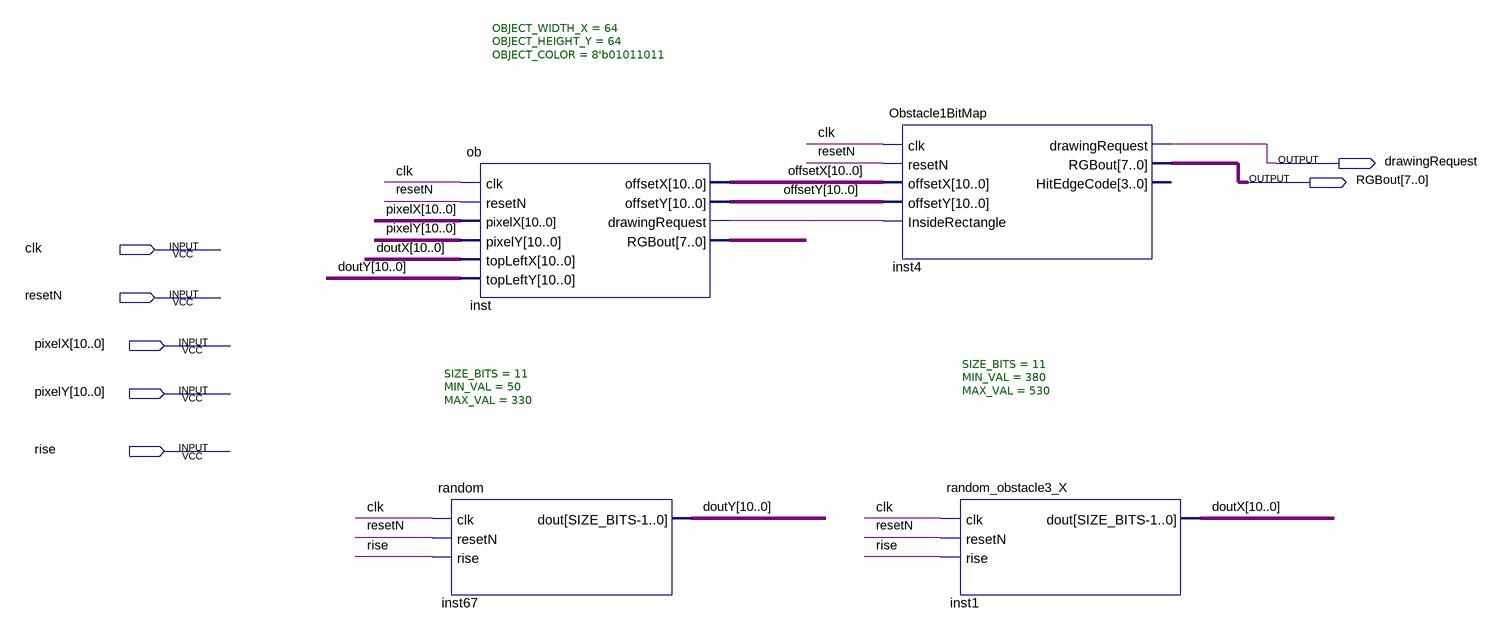
[diagram p0: schematic sheet]
// Quartus schematic Obstacle3.bdf as structural Verilog: 4 symbols, 7 pins
module Obstacle3 (
  input  clk,
  input  resetN,
  input  [10:0] pixelX,
  input  [10:0] pixelY,
  input  rise,
  output drawingRequest,
  output [7:0] RGBout
);

  wire inst_drawingrequest;
  wire [7:0] inst_rgbout;
  wire [10:0] doutX, doutY, offsetX, offsetY;

  ob #(.OBJECT_WIDTH_X(64), .OBJECT_HEIGHT_Y(64), .OBJECT_COLOR(8'b01011011)) inst (
    .clk(clk), .resetN(resetN), .pixelX(pixelX), .pixelY(pixelY), .topLeftX(doutX), .topLeftY(doutY),
    .offsetX(offsetX), .offsetY(offsetY), .drawingRequest(inst_drawingrequest), .RGBout(inst_rgbout));
  random #(.SIZE_BITS(11), .MIN_VAL(50), .MAX_VAL(330)) inst67 (.clk(clk), .resetN(resetN), .rise(rise), .dout(doutY));
  Obstacle1BitMap inst4 (
    .clk(clk), .resetN(resetN), .offsetX(offsetX), .offsetY(offsetY), .InsideRectangle(inst_drawingrequest),
    .drawingRequest(drawingRequest), .RGBout(RGBout));  // open: HitEdgeCode
  random_obstacle3_X #(.SIZE_BITS(11), .MIN_VAL(380), .MAX_VAL(530)) inst1 (
    .clk(clk), .resetN(resetN), .rise(rise), .dout(doutX));
endmodule
